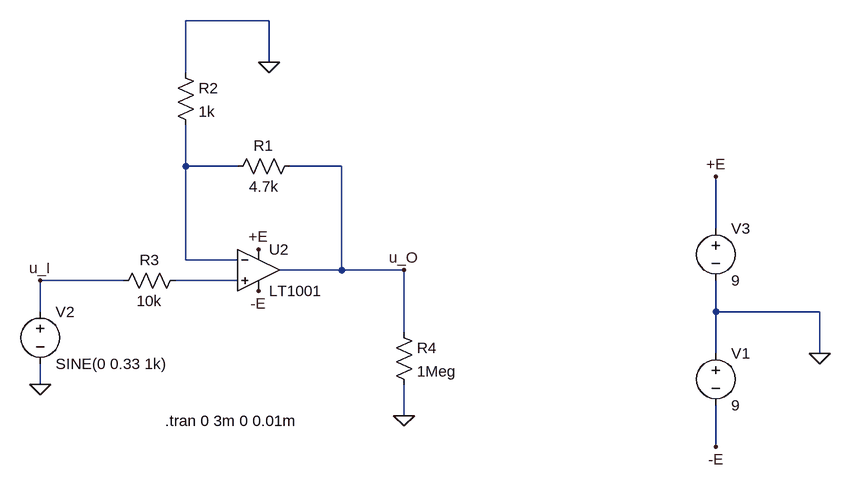
[diagram p0: schematic OpAmp2.asc]
OpAmp2.asc, the LTspice schematic file:
Version 4
SHEET 1 964 680
WIRE 96 -896 -32 -896
WIRE 96 -832 96 -896
WIRE -32 -816 -32 -896
WIRE -32 -672 -32 -736
WIRE 48 -672 -32 -672
WIRE 208 -672 128 -672
WIRE 784 -576 784 -656
WIRE -32 -528 -32 -672
WIRE 48 -528 -32 -528
WIRE 208 -512 208 -672
WIRE 208 -512 112 -512
WIRE 304 -512 208 -512
WIRE -128 -496 -256 -496
WIRE 48 -496 -48 -496
WIRE -256 -448 -256 -496
WIRE 784 -448 784 -496
WIRE 944 -448 784 -448
WIRE 304 -416 304 -512
WIRE 784 -384 784 -448
WIRE 944 -384 944 -448
WIRE -256 -336 -256 -368
WIRE 304 -288 304 -336
WIRE 784 -240 784 -304
FLAG -256 -336 0
FLAG 304 -288 0
FLAG -256 -496 u_I
FLAG 304 -512 u_O
FLAG 944 -384 0
FLAG 784 -240 -E
FLAG 784 -656 +E
FLAG 80 -480 -E
FLAG 80 -544 +E
FLAG 96 -832 0
SYMBOL OpAmps\\LT1001 80 -576 R0
SYMATTR InstName U2
SYMBOL res -32 -512 R90
WINDOW 0 0 56 VBottom 2
WINDOW 3 32 56 VTop 2
SYMATTR InstName R3
SYMATTR Value 10k
SYMBOL voltage -256 -464 R0
WINDOW 123 0 0 Left 0
WINDOW 39 0 0 Left 0
SYMATTR InstName V2
SYMATTR Value SINE(0 0.33 1k)
SYMBOL res 288 -432 R0
SYMATTR InstName R4
SYMATTR Value 1Meg
SYMBOL voltage 784 -400 R0
WINDOW 123 0 0 Left 0
WINDOW 39 0 0 Left 0
SYMATTR InstName V1
SYMATTR Value 9
SYMBOL voltage 784 -592 R0
WINDOW 123 0 0 Left 0
WINDOW 39 0 0 Left 0
SYMATTR InstName V3
SYMATTR Value 9
SYMBOL res 144 -688 R90
WINDOW 0 0 56 VBottom 2
WINDOW 3 32 56 VTop 2
SYMATTR InstName R1
SYMATTR Value 4.7k
SYMBOL res -48 -832 R0
SYMATTR InstName R2
SYMATTR Value 1k
TEXT -64 -280 Left 2 !.tran 0 3m 0 0.01m

The netlist it stands for:
* OpAmp2.asc
XU2 N002 N001 +E -E u_O LT1001  ; pins In+ In- V+ V- OUT
R3 N002 u_I 10k
V2 u_I 0 SINE(0 0.33 1k)
R4 u_O 0 1Meg
V1 0 -E 9
V3 +E 0 9
R1 u_O N001 4.7k
R2 0 N001 1k
.tran 0 3m 0 0.01m
.lib LTC.lib
.backanno
.end

* Results of the author's LTspice run, read from the files saved beside the schematic
* Operating Point, zero values left out:
*   V(+e) = 9 V
*   V(-e) = -9 V
*   I(V3) = -2.25 mA
*   I(V1) = -2.25 mA
*   Ix(u2:3) = 2.25 mA
*   Ix(u2:4) = -2.25 mA
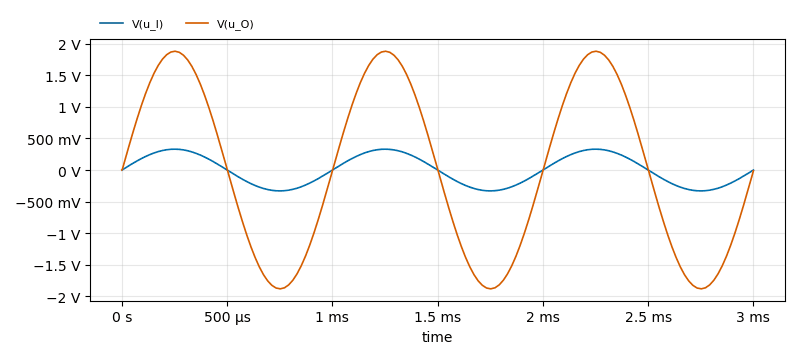
[diagram p1: Transient Analysis of OpAmp2.asc, plotted from the saved traces]
* Transient Analysis, 1 run:
*   V(u_I): min -330 mV, max 330 mV, average 197.7 nV, rms 233.3 mV, last 0 V
*   V(u_O): min -1.879 V, max 1.879 V, average 5.604 µV, rms 1.329 V, last -12.77 mV